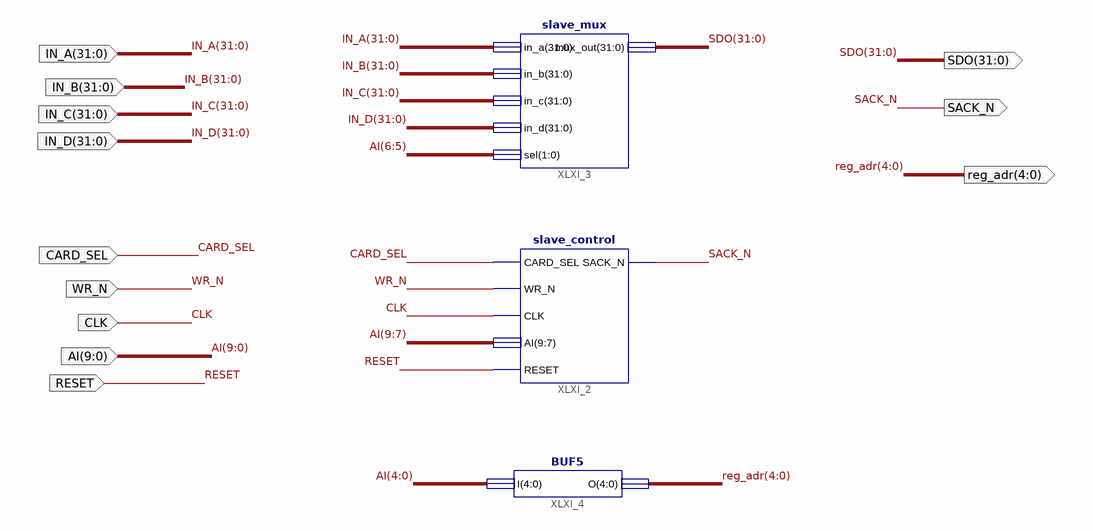
[diagram p0: schematic sheet 1]
// Xilinx ISE schematic slave.sch (spartan6) as structural Verilog: 3 symbols, 12 ports
module slave (
  input  [31:0] IN_C,
  input  CLK,
  input  [31:0] IN_A,
  input  [31:0] IN_B,
  input  [31:0] IN_D,
  input  CARD_SEL,
  input  WR_N,
  input  RESET,
  input  [9:0] AI,
  output SACK_N,
  output [31:0] SDO,
  output [4:0] reg_adr
);

  slave_control XLXI_2 (.CARD_SEL(CARD_SEL), .WR_N(WR_N), .CLK(CLK), .AI(AI[9:7]), .SACK_N(SACK_N), .RESET(RESET));
  slave_mux XLXI_3 (.in_a(IN_A), .in_b(IN_B), .in_c(IN_C), .in_d(IN_D), .sel(AI[6:5]), .mux_out(SDO));
  BUF5 XLXI_4 (.I(AI[4:0]), .O(reg_adr));
endmodule
